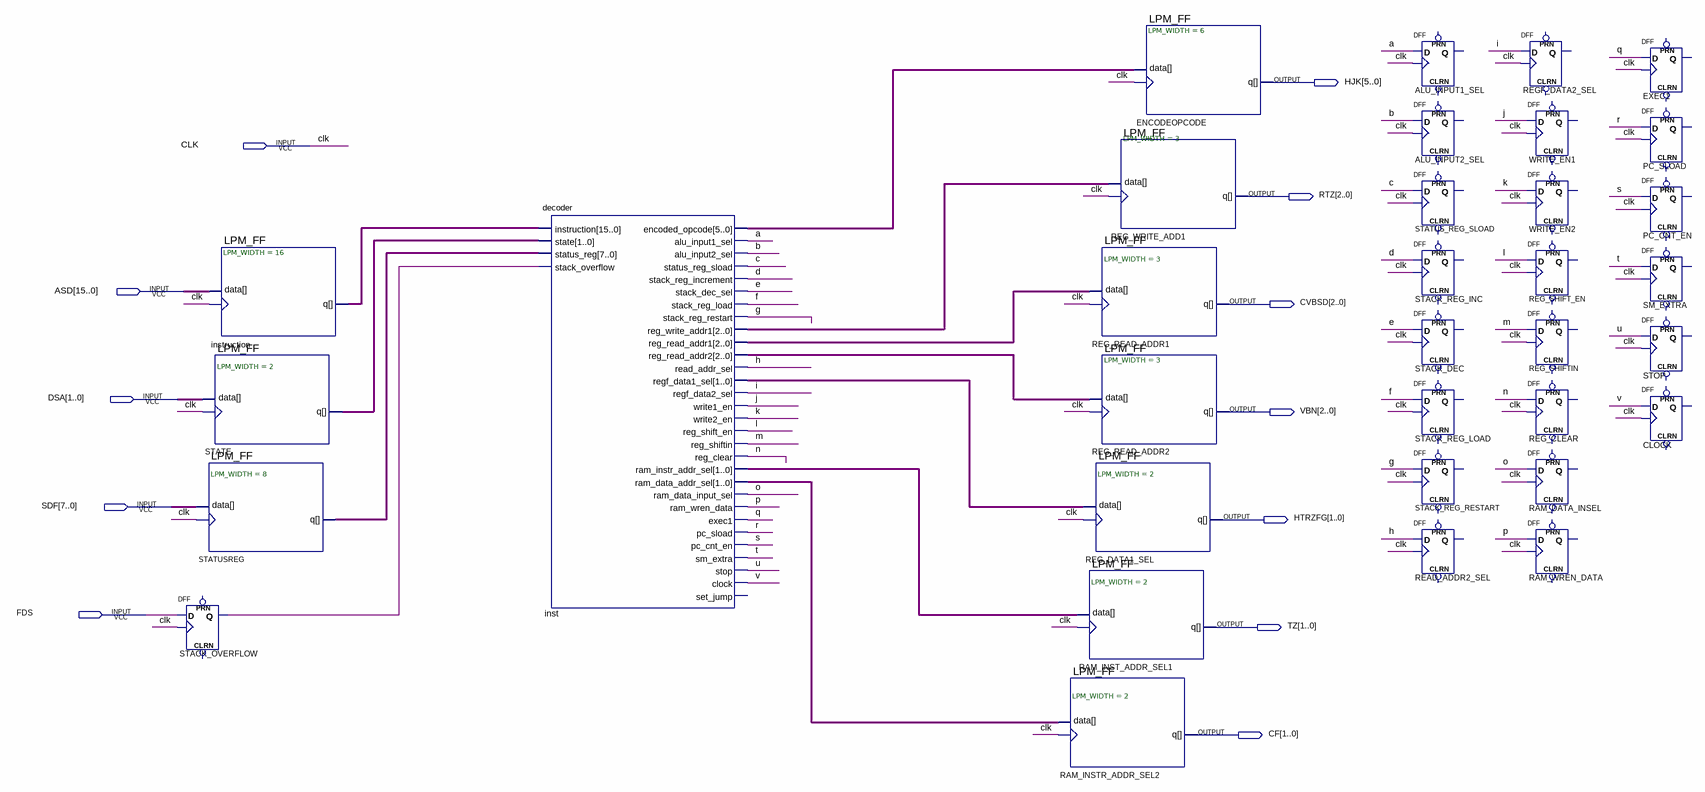
[diagram p0: schematic sheet]
// Quartus schematic decoderspeedtest.bdf as structural Verilog: 34 symbols, 12 pins
module decoderspeedtest (
  input  CLK,
  input  [15:0] ASD,
  input  [1:0] DSA,
  input  [7:0] SDF,
  input  FDS,
  output [5:0] HJK,
  output [2:0] RTZ,
  output [2:0] CVBSD,
  output [2:0] VBN,
  output [1:0] HTRZFG,
  output [1:0] TZ,
  output [1:0] CF
);

  wire a, b, c, d, e, f, g, h, i, j, k, l, m, n, o, p, q, r, s, STACK_OVERFLOW_q, t, u, v;
  wire [1:0] inst_ram_data_addr_sel, inst_ram_instr_addr_sel, inst_regf_data1_sel, STATE_q;
  wire [2:0] inst_reg_read_addr1, inst_reg_read_addr2, inst_reg_write_addr1;
  wire [5:0] inst_encoded_opcode;
  wire [7:0] STATUSREG_q;
  wire [15:0] instruction_q;

  LPM_FF #(.LPM_WIDTH(16)) instruction (.clock(CLK), .data(ASD), .q(instruction_q));
  LPM_FF #(.LPM_WIDTH(2)) STATE (.clock(CLK), .data(DSA), .q(STATE_q));
  LPM_FF #(.LPM_WIDTH(8)) STATUSREG (.clock(CLK), .data(SDF), .q(STATUSREG_q));
  DFF STACK_OVERFLOW (.CLK(CLK), .D(FDS), .Q(STACK_OVERFLOW_q));  // open: CLRN, PRN
  decoder inst (
    .instruction(instruction_q), .state(STATE_q), .status_reg(STATUSREG_q),
    .stack_overflow(STACK_OVERFLOW_q), .encoded_opcode(inst_encoded_opcode), .alu_input1_sel(a),
    .alu_input2_sel(b), .status_reg_sload(c), .stack_reg_increment(d), .stack_dec_sel(e), .stack_reg_load(f),
    .stack_reg_restart(g), .reg_write_addr1(inst_reg_write_addr1), .reg_read_addr1(inst_reg_read_addr1),
    .reg_read_addr2(inst_reg_read_addr2), .read_addr_sel(h), .regf_data1_sel(inst_regf_data1_sel),
    .regf_data2_sel(i), .write1_en(j), .write2_en(k), .reg_shift_en(l), .reg_shiftin(m), .reg_clear(n),
    .ram_instr_addr_sel(inst_ram_instr_addr_sel), .ram_data_addr_sel(inst_ram_data_addr_sel),
    .ram_data_input_sel(o), .ram_wren_data(p), .exec1(q), .pc_sload(r), .pc_cnt_en(s), .sm_extra(t),
    .stop(u), .clock(v));  // open: set_jump
  LPM_FF #(.LPM_WIDTH(2)) REG_DATA1_SEL (.clock(CLK), .data(inst_regf_data1_sel), .q(HTRZFG));
  LPM_FF #(.LPM_WIDTH(2)) RAM_INST_ADDR_SEL1 (.clock(CLK), .data(inst_ram_instr_addr_sel), .q(TZ));
  LPM_FF #(.LPM_WIDTH(2)) RAM_INSTR_ADDR_SEL2 (.clock(CLK), .data(inst_ram_data_addr_sel), .q(CF));
  LPM_FF #(.LPM_WIDTH(6)) ENCODEOPCODE (.clock(CLK), .data(inst_encoded_opcode), .q(HJK));
  LPM_FF #(.LPM_WIDTH(3)) REG_WRITE_ADD1 (.clock(CLK), .data(inst_reg_write_addr1), .q(RTZ));
  LPM_FF #(.LPM_WIDTH(3)) REG_READ_ADDR1 (.clock(CLK), .data(inst_reg_read_addr1), .q(CVBSD));
  LPM_FF #(.LPM_WIDTH(3)) REG_READ_ADDR2 (.clock(CLK), .data(inst_reg_read_addr2), .q(VBN));
  DFF ALU_INPUT1_SEL (.CLK(CLK), .D(a));  // open: CLRN, PRN, Q
  DFF ALU_INPUT2_SEL (.CLK(CLK), .D(b));  // open: CLRN, PRN, Q
  DFF STATUS_REG_SLOAD (.CLK(CLK), .D(c));  // open: CLRN, PRN, Q
  DFF STACK_REG_INC (.CLK(CLK), .D(d));  // open: CLRN, PRN, Q
  DFF STACK_DEC (.CLK(CLK), .D(e));  // open: CLRN, PRN, Q
  DFF STACK_REG_LOAD (.CLK(CLK), .D(f));  // open: CLRN, PRN, Q
  DFF STACK_REG_RESTART (.CLK(CLK), .D(g));  // open: CLRN, PRN, Q
  DFF READ_ADDR2_SEL (.CLK(CLK), .D(h));  // open: CLRN, PRN, Q
  DFF REGF_DATA2_SEL (.CLK(CLK), .D(i));  // open: CLRN, PRN, Q
  DFF WRITE_EN1 (.CLK(CLK), .D(j));  // open: CLRN, PRN, Q
  DFF WRITE_EN2 (.CLK(CLK), .D(k));  // open: CLRN, PRN, Q
  DFF REG_SHIFT_EN (.CLK(CLK), .D(l));  // open: CLRN, PRN, Q
  DFF REG_SHIFTIN (.CLK(CLK), .D(m));  // open: CLRN, PRN, Q
  DFF REG_CLEAR (.CLK(CLK), .D(n));  // open: CLRN, PRN, Q
  DFF RAM_DATA_INSEL (.CLK(CLK), .D(o));  // open: CLRN, PRN, Q
  DFF RAM_WREN_DATA (.CLK(CLK), .D(p));  // open: CLRN, PRN, Q
  DFF EXEC1 (.CLK(CLK), .D(q));  // open: CLRN, PRN, Q
  DFF PC_SLOAD (.CLK(CLK), .D(r));  // open: CLRN, PRN, Q
  DFF PC_CNT_EN (.CLK(CLK), .D(s));  // open: CLRN, PRN, Q
  DFF SM_EXTRA (.CLK(CLK), .D(t));  // open: CLRN, PRN, Q
  DFF STOP (.CLK(CLK), .D(u));  // open: CLRN, PRN, Q
  DFF CLOCK (.CLK(CLK), .D(v));  // open: CLRN, PRN, Q
endmodule
